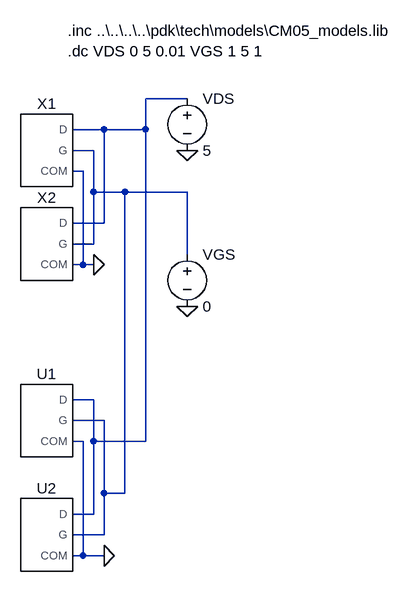
[diagram p0: schematic Unidad_N_Prueba.asc]
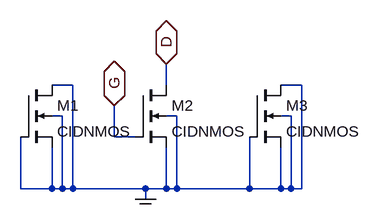
[diagram p1: sub-circuit unidad_n.asc]
Unidad_N_Prueba.asc, the LTspice schematic file:
Version 4.1
SHEET 1 880 796
WIRE 352 64 288 64
WIRE 224 112 176 112
WIRE 288 112 288 64
WIRE 288 112 224 112
WIRE 208 144 176 144
WIRE 192 176 176 176
WIRE 208 208 208 144
WIRE 256 208 208 208
WIRE 352 208 256 208
WIRE 224 256 224 112
WIRE 224 256 176 256
WIRE 208 288 208 208
WIRE 208 288 176 288
WIRE 352 304 352 208
WIRE 192 320 192 176
WIRE 192 320 176 320
WIRE 208 320 192 320
WIRE 208 528 176 528
WIRE 224 560 176 560
WIRE 192 592 176 592
WIRE 208 592 208 528
WIRE 288 592 288 112
WIRE 288 592 208 592
WIRE 224 672 224 560
WIRE 256 672 256 208
WIRE 256 672 224 672
WIRE 208 704 208 592
WIRE 208 704 176 704
WIRE 224 736 224 672
WIRE 224 736 176 736
WIRE 192 768 192 592
WIRE 192 768 176 768
WIRE 224 768 192 768
FLAG 208 320 0
FLAG 352 144 0
FLAG 352 384 0
FLAG 224 768 0
SYMBOL Unidad_N 128 144 R0
SYMATTR InstName X1
SYMBOL Unidad_N 128 288 R0
SYMATTR InstName X2
SYMBOL voltage 352 48 R0
WINDOW 123 0 0 Left 0
WINDOW 39 0 0 Left 0
SYMATTR InstName VDS
SYMATTR Value 5
SYMBOL voltage 352 288 R0
WINDOW 123 0 0 Left 0
WINDOW 39 0 0 Left 0
SYMATTR InstName VGS
SYMATTR Value 0
SYMBOL Unidad_N_lay 128 560 R0
SYMATTR InstName U1
SYMBOL Unidad_N_lay 128 736 R0
SYMATTR InstName U2
TEXT 168 -40 Left 2 !.inc ..\\..\\..\\..\\pdk\\tech\\models\\CM05_models.lib\n.dc VDS 0 5 0.01 VGS 1 5 1

unidad_n.asc, the sub-circuit schematic file:
Version 4.1
SHEET 1 880 680
WIRE 96 96 64 96
WIRE 240 96 240 64
WIRE 448 96 416 96
WIRE 80 144 64 144
WIRE 256 144 240 144
WIRE 432 144 416 144
WIRE 160 176 160 128
WIRE 192 176 160 176
WIRE 16 256 16 176
WIRE 64 256 64 192
WIRE 64 256 16 256
WIRE 80 256 80 144
WIRE 80 256 64 256
WIRE 96 256 96 96
WIRE 96 256 80 256
WIRE 208 256 96 256
WIRE 240 256 240 192
WIRE 240 256 208 256
WIRE 256 256 256 144
WIRE 256 256 240 256
WIRE 368 256 368 176
WIRE 368 256 256 256
WIRE 416 256 416 192
WIRE 416 256 368 256
WIRE 432 256 432 144
WIRE 432 256 416 256
WIRE 448 256 448 96
WIRE 448 256 432 256
WIRE 208 272 208 256
FLAG 208 272 COM
IOPIN 208 272 BiDir
FLAG 160 128 G
IOPIN 160 128 BiDir
FLAG 240 64 D
IOPIN 240 64 BiDir
SYMBOL nmos4 16 96 R0
SYMATTR InstName M1
SYMATTR Value CIDNMOS
SYMATTR Value2 l=10u w=100u
SYMBOL nmos4 192 96 R0
SYMATTR InstName M2
SYMATTR Value CIDNMOS
SYMATTR Value2 l=10u w=100u
SYMBOL nmos4 368 96 R0
SYMATTR InstName M3
SYMATTR Value CIDNMOS
SYMATTR Value2 l=10u w=100u

The netlist it stands for:
* Unidad_N_Prueba.asc
X§X1 N001 N002 0 unidad_n
X§X2 N001 N002 0 unidad_n
VDS N001 0 5
VGS N002 0 0
X§U1 N001 N002 0 Unidad_N  ; pins D G COM
X§U2 N001 N002 0 Unidad_N  ; pins D G COM

* block symbol definitions
.subckt unidad_n D G COM
M1 COM COM COM COM CIDNMOS l=10u w=100u
M2 D G COM COM CIDNMOS l=10u w=100u
M3 COM COM COM COM CIDNMOS l=10u w=100u
.ends unidad_n

.model NMOS NMOS
.model PMOS PMOS
.lib standard.mos
.inc ..\..\..\..\pdk\tech\models\CM05_models.lib
.dc VDS 0 5 0.01 VGS 1 5 1
.backanno
.end